# Altium project MX233.PrjPcb
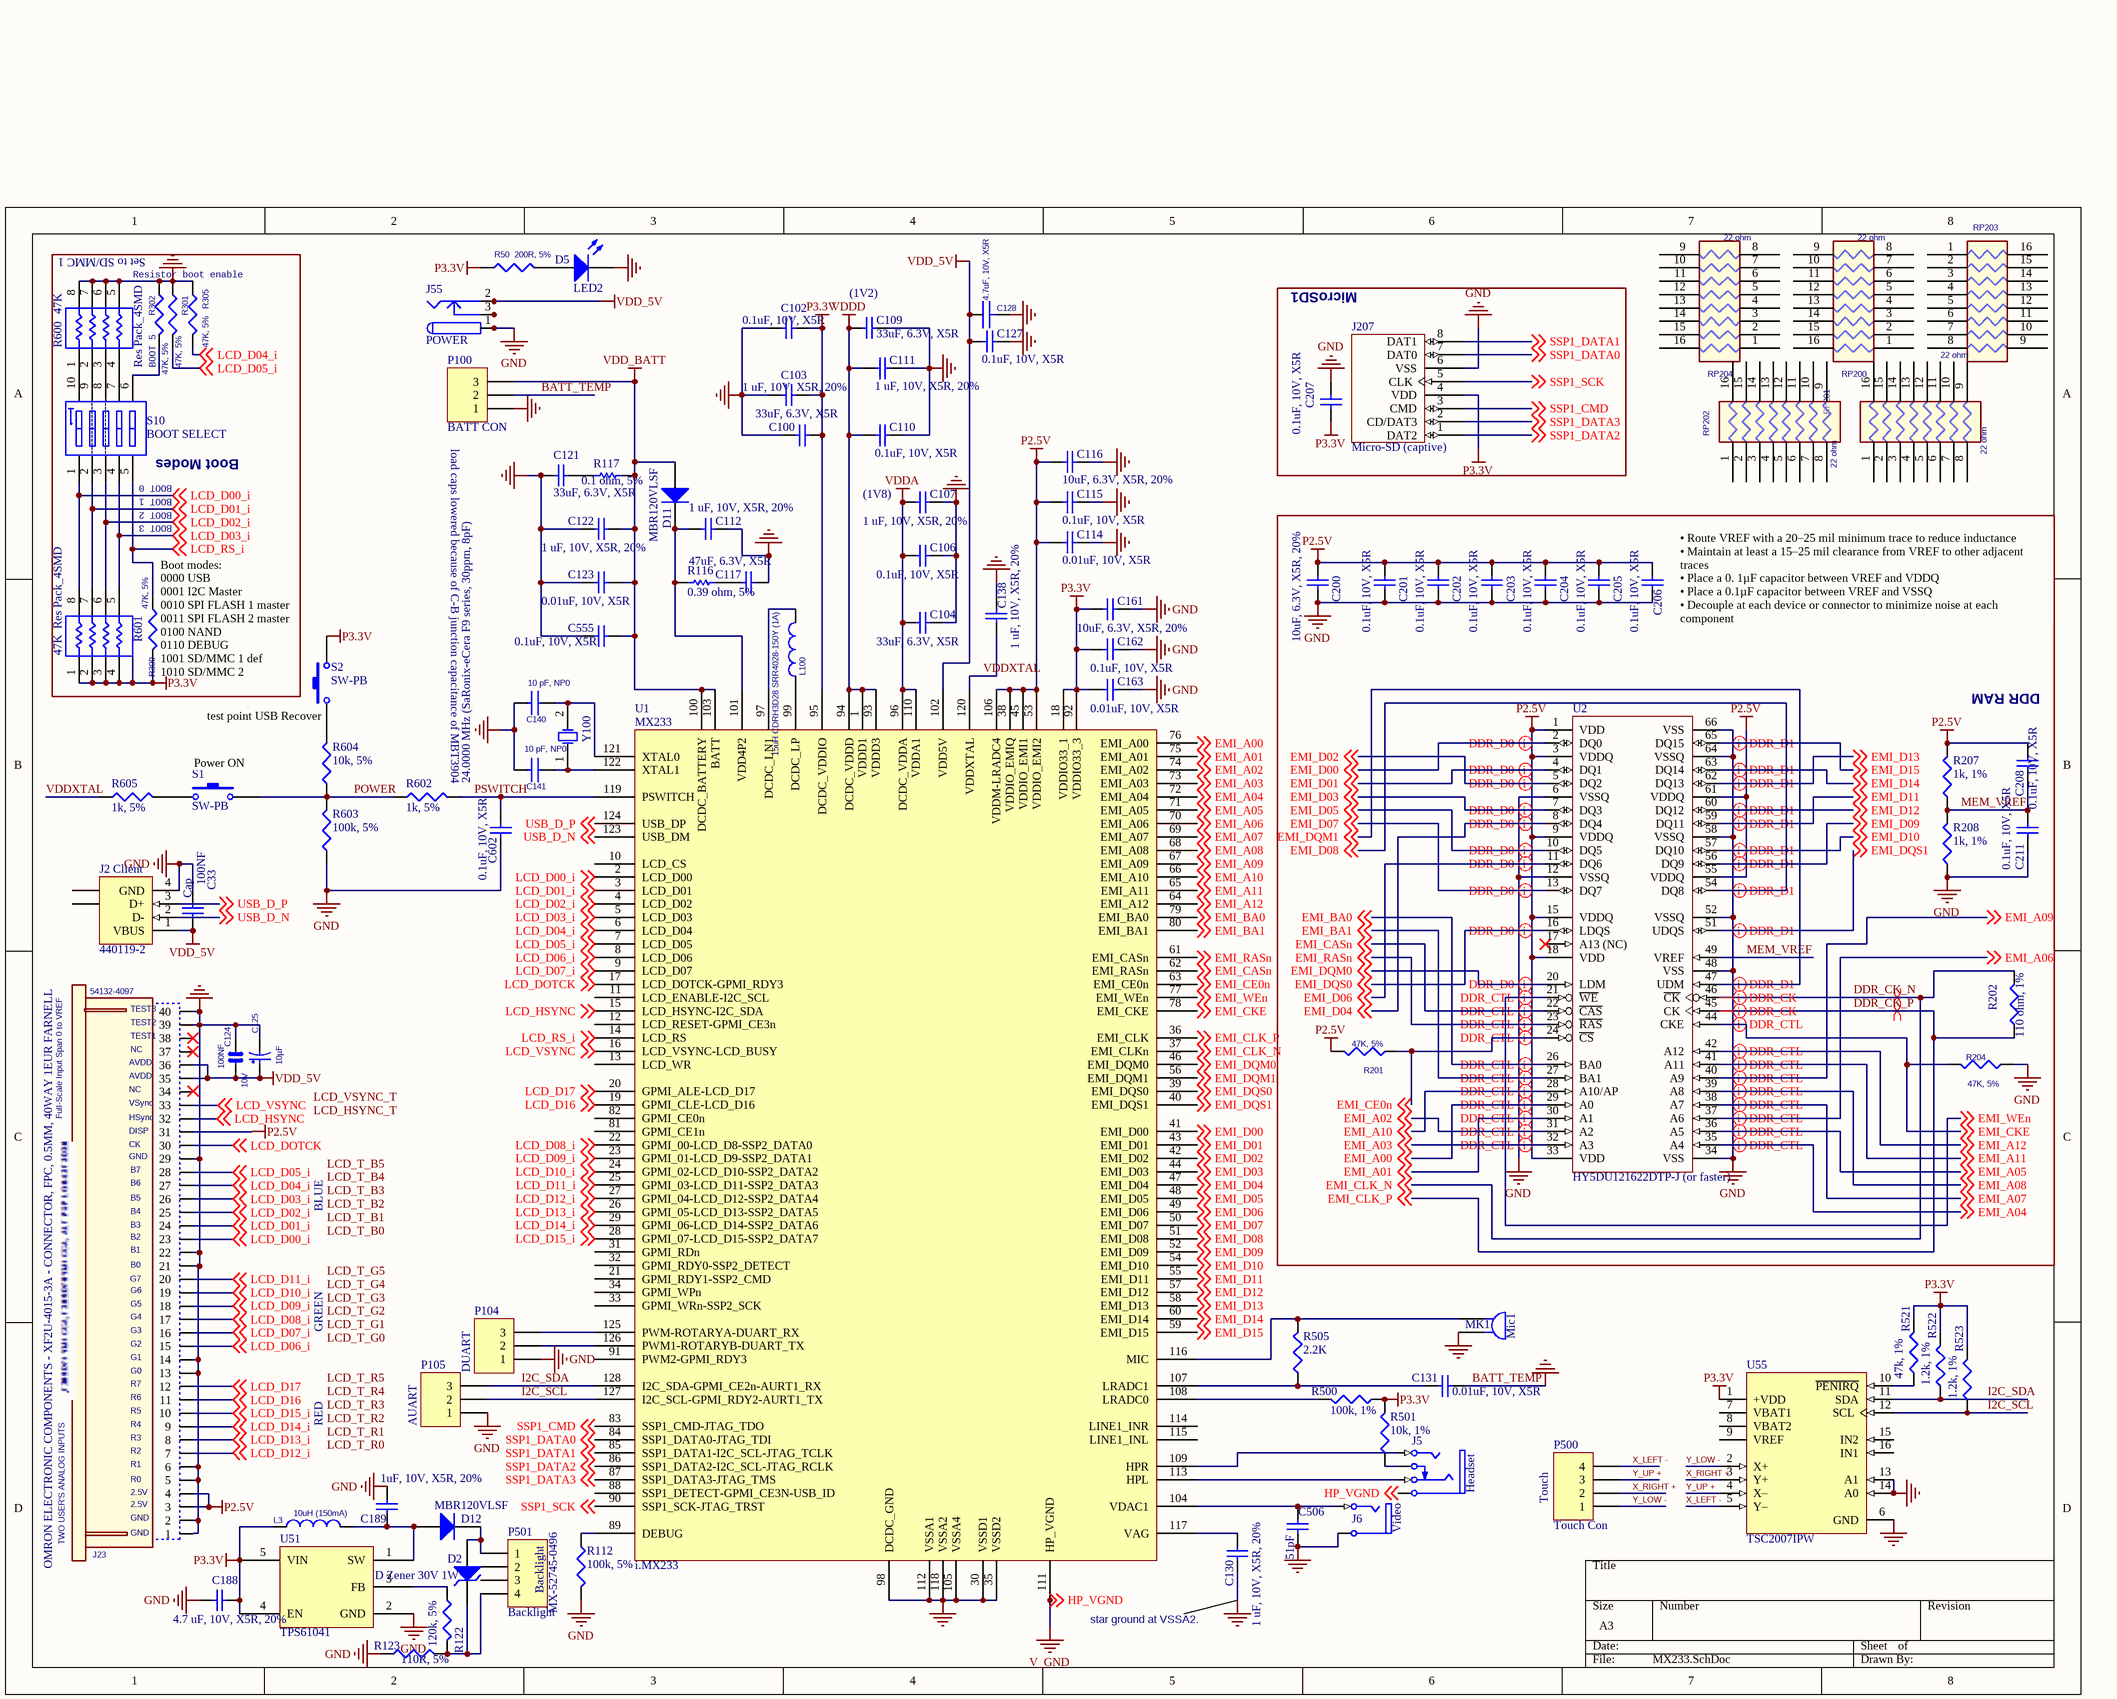
[diagram p0: MX233.SchDoc]
1 sheet, 103 parts. Net scope: global (net labels, ports and power ports of the same name join across sheets).
Board file: MX233.PcbDoc

## Sheet MX233.SchDoc
size A3

### Parts
C33  Cap  value 100NF  [CAPC1608L]
C100  33uF, 6.3V, X5R  [CAPC3216L]
C102  0.1uF, 10V, X5R  [CAPC1608L]
C103  1 uF, 10V, X5R, 20%  [CAPC1608L]
C104  33uF, 6.3V, X5R  [CAPC3216L]
C106  0.1uF, 10V, X5R  [CAPC1608L]
C107  1 uF, 10V, X5R, 20%  [CAPC1608L]
C109  33uF, 6.3V, X5R  [CAPC3216L]
C110  0.1uF, 10V, X5R  [CAPC1608L]
C111  1 uF, 10V, X5R, 20%  [CAPC1608L]
C112  1 uF, 10V, X5R, 20%  [CAPC1608L]
C114  0.01uF, 10V, X5R  [CAPC1608L]
C115  0.1uF, 10V, X5R  [CAPC1608L]
C116  10uF, 6.3V, X5R, 20%  [CAPC2012L]
C117  47uF, 6.3V, X5R  [CAPC3216L]
C121  33uF, 6.3V, X5R  [CAPC3216L]
C122  1 uF, 10V, X5R, 20%  [CAPC1608L]
C123  0.01uF, 10V, X5R  [CAPC1608L]
C124  VAL: 100NF  [CAPC1608L]  (hidden comment: GRM188-100NF-16V)
C125  TEN: 10V  VAL: 10µF  [CAPC3216L]  (hidden comment: TPSA 10uF-10V)
C127  0.1uF, 10V, X5R  [CAPC1608L]
C128  4.7uF, 10V, X5R  [CAPC2012L]
C130  1 uF, 10V, X5R, 20%  [CAPC1608L]
C131  0.01uF, 10V, X5R  [CAPC1608L]
C138  1 uF, 10V, X5R, 20%  [CAPC1608L]
C140  10 pF, NP0  [CAPC1608L]
C141  10 pF, NP0  [CAPC1608L]
C161  10uF, 6.3V, X5R, 20%  [CAPC2012L]
C162  0.1uF, 10V, X5R  [CAPC1608L]
C163  0.01uF, 10V, X5R  [CAPC1608L]
C188  4.7 uF, 10V, X5R, 20%  [CAPC1608L]
C189  1uF, 10V, X5R, 20%  [CAPC1608L]
C200  10uF, 6.3V, X5R, 20%  [CAPC2012L]
C201  0.1uF, 10V, X5R  [CAPC1608L]
C202  0.1uF, 10V, X5R  [CAPC1608L]
C203  0.1uF, 10V, X5R  [CAPC1608L]
C204  0.1uF, 10V, X5R  [CAPC1608L]
C205  0.1uF, 10V, X5R  [CAPC1608L]
C206  0.1uF, 10V, X5R  [CAPC1608L]
C207  0.1uF, 10V, X5R  [CAPC1608L]
C208  0.1uF, 10V, X5R  [CAPC1608L]
C211  0.1uF, 10V, X5R  [CAPC1608L]
C506  51pF  [CAPC1608L]
C555  0.1uF, 10V, X5R  [CAPC1608L]
C602  0.1uF, 10V, X5R  [CAPC1608L]
D2  D Zener 30V 1W  [DIODE_SMC]
D5  LED2  [DSO-F2/D6.1]
D11  MBR120VLSF  [SOD123/X.85]
D12  MBR120VLSF  [SOD123/X.85]
J2  440119-2  [440247]
J5  Headset  [JACK/6-V4A]
J6  Video  [JACK/6-V2]
J23  VAL: 54132-4097  [FH12-40S-0.5SH]  (hidden comment: FPC_54132-4097 MOLEX)
J55  POWER  [KLD-0202]
J207  Micro-SD (captive)  [SDAMB-012_miniSD]
L3  10uH (150mA)  [INDC4532L]
L100  15uH CDRH3D28 SRR4028-150Y (1A)  [INDC4532L]
MK1  Mic1  [PIN2]
P100  BATT CON  [HDR1X3]
P104  DUART  [HDR1X3]
P105  AUART  [HDR1X3]
P500  Touch Con  [FH12-10(4)SA-1SH]
P501  Backlight  [FH12-10(4)SA-1SH]
R50  200R, 5%  [RESC1608L]
R112  100k, 5%  [RESC1608L]
R116  0.39 ohm, 5%  [RESC1608L]
R117  0.1 ohm, 5%  [RESC1608L]
R122  120k, 5%  [RESC1608L]
R123  110R, 5%  [RESC1608L]
R201  47K, 5%  [RESC1608L]
R202  110 ohm, 1%  [RESC1608L]
R204  47K, 5%  [RESC1608L]
R207  1k, 1%  [RESC1608L]
R208  1k, 1%  [RESC1608L]
R300  47K, 5%  [RESC1608L]
R301  47K, 5%  [RESC1608L]
R302  47K, 5%  [RESC1608L]
R305  47K, 5%  [RESC1608L]
R500  100k, 1%  [RESC1608L]
R501  10k, 1%  [RESC1608L]
R505  2.2K  [RESC1608L]
R521  47k, 1%  [RESC1608L]
R522  1.2k, 1%  [RESC1608L]
R523  1.2k, 1%  [RESC1608L]
R600  Res Pack_4SMD  value 47K  [EXB38V]
R601  Res Pack_4SMD  value 47K  [EXB38V]
R602  1k, 5%  [RESC1608L]
R603  100k, 5%  [RESC1608L]
R604  10k, 5%  [RESC1608L]
R605  1k, 5%  [RESC1608L]
RP200  22 ohm  [EXB2HV]
RP201  22 ohm  [EXB2HV]
RP202  22 ohm  [EXB2HV]
RP203  22 ohm  [EXB2HV]
RP204  22 ohm  [EXB2HV]
S1  SW-PB  [SPST-2]
S2  SW-PB  [SPST-2]
S10  BOOT SELECT  [DIP-10/D14.5]
U1  MX233  [TSQFP40P1600X1600-128M]
U2  HY5DU121622DTP-J (or faster)  [TSOP65P1400-36M - duplicate]
U51  TPS61041  [SOT23-5BM]
U55  TSC2007IPW  [PW016]
Y100  24.0000 MHz (SaRonix-eCera F9 series, 30ppm, 8pF)  [HC-49U]

### Blocks framed on the sheet
Boot Modes: R300-R302 R305 R600 R601 S10
MicroSD1: C207 J207
DDR RAM: C200-C206 C208 C211 R201 R202 R204 R207 R208 U2

### Nets
BATT_TEMP: C33.2 C100.1 C102.2 C103.1 C104.1 C106.2 C107.1 C109.1 C110.2 C111.1 C112.1 C114.2 C115.2 C116.1 C117.1 C121.1 C122.1 C123.2 C127.2 C128.2 C130.1 C131.2 C138.1 C140.2 C141.2 C161.1 C162.2 C163.2 C188.1 C189.2 C200.2 C201.2 C202.2 C203.2 C204.2 C205.2 C206.2 C207.2 C211.2 C506.1 C555.2 C602.2 D5.2(K) J2.4(GND) J6.5(S) J55.1 J55.1A J55.1B J207.6(VSS) MK1.2 P100.1 P100.2 P104.1 P105.1 R112.2 R123.1 R204.2 R208.1 R301.1 R302.1 R305.1 R600.5 R600.6 R600.7 R600.8 R603.1 U1.30(VSSD1) U1.35(VSSD2) U1.98(DCDC_GND) U1.105(VSSA4) U1.112(VSSA1) U1.118(VSSA2) U2.6(VSSQ) U2.12(VSSQ) U2.34(VSS) U2.48(VSS) U2.52(VSSQ) U2.58(VSSQ) U2.64(VSSQ) U2.66(VSS) U51.2(GND) U55.6(GND) U55.13(A1) U55.14(A0)  [also labelled GND]
GND_POWER: C124.1(E1) C125.2(M) J23.1 J23.2 J23.5 J23.6 J23.13 J23.14 J23.21 J23.22 J23.29 J23.39 J23.40
P2.5V: C114.1 C115.1 C116.2 C200.1 C201.1 C202.1 C203.1 C204.1 C205.1 C206.1 C208.1 J23.3 J23.4 J23.31 R201.1 R207.2 U1.38(VDDIO_EMIQ) U1.45(VDDIO_EMI1) U1.53(VDDIO_EMI2) U1.106(VDDM-LRADC4) U2.1(VDD) U2.3(VDDQ) U2.9(VDDQ) U2.15(VDDQ) U2.18(VDD) U2.33(VDD) U2.55(VDDQ) U2.61(VDDQ)
P3.3V: C100.2 C102.1 C103.2 C161.2 C162.1 C163.1 C188.2 C207.1 J207.4(VDD) L3.1 R50.1 R300.2 R500.1 R501.2 R521.2 R522.2 R523.2 R601.1 R601.2 R601.3 R601.4 S2.2 U1.18(VDDIO33_1) U1.92(VDDIO33_3) U1.95(DCDC_VDDIO) U51.4(EN) U51.5(VIN) U55.1(+VDD)
V_GND: J5.5(S) U1.111(HP_VGND) ; off-sheet HP_VGND  [also labelled HP_VGND]
VDD_5V: C33.1 C124.2(E2) C125.1(P) C127.1 C128.1 J2.1(VBUS) J23.35 J23.36 J55.2 J55.2A J55.2B U1.102(VDD5V)
VDD_BATT: C122.2 C123.1 C555.1 D11.1(A) P100.3 R117.1 U1.100(DCDC_BATTERY) U1.103(BATT)
VDDA: C104.2 C106.1 C107.2 U1.96(DCDC_VDDA) U1.110(VDDA1)
VDDD: C109.2 C110.1 C111.2 U1.1(VDDD1) U1.93(VDDD3) U1.94(DCDC_VDDD)
DDR_CK_N: R202.2 U1.37(EMI_CLKn) U2.46(~{CK}) ; off-sheet EMI_CLK_N  [also labelled EMI_CLK_N]
DDR_CK_P: R202.1 U1.36(EMI_CLK) U2.45(CK) ; off-sheet EMI_CLK_P  [also labelled EMI_CLK_P]
EMI_A00: U1.76(EMI_A00) U2.29(A0) ; off-sheet EMI_A00
EMI_A01: U1.75(EMI_A01) U2.30(A1) ; off-sheet EMI_A01
EMI_A02: U1.74(EMI_A02) U2.31(A2) ; off-sheet EMI_A02
EMI_A03: U1.73(EMI_A03) U2.32(A3) ; off-sheet EMI_A03
EMI_A04: U1.72(EMI_A04) U2.35(A4) ; off-sheet EMI_A04
EMI_A05: U1.71(EMI_A05) U2.36(A5) ; off-sheet EMI_A05
EMI_A06: U1.70(EMI_A06) U2.37(A6) ; off-sheet EMI_A06
EMI_A07: U1.69(EMI_A07) U2.38(A7) ; off-sheet EMI_A07
EMI_A08: U1.68(EMI_A08) U2.39(A8) ; off-sheet EMI_A08
EMI_A09: U1.67(EMI_A09) U2.40(A9) ; off-sheet EMI_A09
EMI_A10: U1.66(EMI_A10) U2.28(A10/AP) ; off-sheet EMI_A10
EMI_A11: U1.65(EMI_A11) U2.41(A11) ; off-sheet EMI_A11
EMI_A12: U1.64(EMI_A12) U2.42(A12) ; off-sheet EMI_A12
EMI_BA0: U1.79(EMI_BA0) U2.26(BA0) ; off-sheet EMI_BA0
EMI_BA1: U1.80(EMI_BA1) U2.27(BA1) ; off-sheet EMI_BA1
EMI_CASn: U1.62(EMI_RASn) U2.22(~{CAS}) ; off-sheet EMI_CASn
EMI_CE0n: R201.2 U1.63(EMI_CE0n) U2.24(~{CS}) ; off-sheet EMI_CE0n
EMI_CKE: R204.1 U1.78(EMI_CKE) U2.44(CKE) ; off-sheet EMI_CKE
EMI_D00: U1.41(EMI_D00) U2.2(DQ0) ; off-sheet EMI_D00
EMI_D01: U1.43(EMI_D01) U2.4(DQ1) ; off-sheet EMI_D01
EMI_D02: U1.42(EMI_D02) U2.5(DQ2) ; off-sheet EMI_D02
EMI_D03: U1.44(EMI_D03) U2.7(DQ3) ; off-sheet EMI_D03
EMI_D04: U1.47(EMI_D04) U2.8(DQ4) ; off-sheet EMI_D04
EMI_D05: U1.48(EMI_D05) U2.10(DQ5) ; off-sheet EMI_D05
EMI_D06: U1.49(EMI_D06) U2.11(DQ6) ; off-sheet EMI_D06
EMI_D07: U1.50(EMI_D07) U2.13(DQ7) ; off-sheet EMI_D07
EMI_D08: U1.51(EMI_D08) U2.54(DQ8) ; off-sheet EMI_D08
EMI_D09: U1.52(EMI_D09) U2.56(DQ9) ; off-sheet EMI_D09
EMI_D10: U1.54(EMI_D10) U2.57(DQ10) ; off-sheet EMI_D10
EMI_D11: U1.55(EMI_D11) U2.59(DQ11) ; off-sheet EMI_D11
EMI_D12: U1.57(EMI_D12) U2.60(DQ12) ; off-sheet EMI_D12
EMI_D13: U1.58(EMI_D13) U2.62(DQ13) ; off-sheet EMI_D13
EMI_D14: U1.60(EMI_D14) U2.63(DQ14) ; off-sheet EMI_D14
EMI_D15: U1.59(EMI_D15) U2.65(DQ15) ; off-sheet EMI_D15
EMI_DQM0: U1.46(EMI_DQM0) U2.20(LDM) ; off-sheet EMI_DQM0
EMI_DQM1: U1.56(EMI_DQM1) U2.47(UDM) ; off-sheet EMI_DQM1
EMI_DQS0: U1.39(EMI_DQS0) U2.16(LDQS) ; off-sheet EMI_DQS0
EMI_DQS1: U1.40(EMI_DQS1) U2.51(UDQS) ; off-sheet EMI_DQS1
EMI_RASn: U1.61(EMI_CASn) U2.23(~{RAS}) ; off-sheet EMI_RASn
EMI_WEn: U1.77(EMI_WEn) U2.21(~{WE}) ; off-sheet EMI_WEn
I2C_SCL: P105.2 R523.1 U1.127(I2C_SCL-GPMI_RDY2-AURT1_TX) U55.12(SCL)
I2C_SDA: P105.3 R522.1 U1.128(I2C_SDA-GPMI_CE2n-AURT1_RX) U55.11(SDA)
LCD_D00_i: J23.23 R601.8 S10.1(A1) U1.2(LCD_D00) ; off-sheet LCD_D00_i
LCD_D01_i: J23.24 R601.7 S10.2(A2) U1.3(LCD_D01) ; off-sheet LCD_D01_i
LCD_D02_i: J23.25 R601.6 S10.3(A3) U1.4(LCD_D02) ; off-sheet LCD_D02_i
LCD_D03_i: J23.26 R601.5 S10.4(A4) U1.5(LCD_D03) ; off-sheet LCD_D03_i
LCD_D04_i: J23.27 R305.2 U1.6(LCD_D04) ; off-sheet LCD_D04_i
LCD_D05_i: J23.28 R301.2 U1.7(LCD_D05) ; off-sheet LCD_D05_i
LCD_D06_i: J23.15 U1.8(LCD_D06) ; off-sheet LCD_D06_i
LCD_D07_i: J23.16 U1.9(LCD_D07) ; off-sheet LCD_D07_i
LCD_D08_i: J23.17 U1.22(GPMI_00-LCD_D8-SSP2_DATA0) ; off-sheet LCD_D08_i
LCD_D09_i: J23.18 U1.23(GPMI_01-LCD_D9-SSP2_DATA1) ; off-sheet LCD_D09_i
LCD_D10_i: J23.19 U1.24(GPMI_02-LCD_D10-SSP2_DATA2) ; off-sheet LCD_D10_i
LCD_D11_i: J23.20 U1.25(GPMI_03-LCD_D11-SSP2_DATA3) ; off-sheet LCD_D11_i
LCD_D12_i: J23.7 U1.27(GPMI_04-LCD_D12-SSP2_DATA4) ; off-sheet LCD_D12_i
LCD_D13_i: J23.8 U1.26(GPMI_05-LCD_D13-SSP2_DATA5) ; off-sheet LCD_D13_i
LCD_D14_i: J23.9 U1.29(GPMI_06-LCD_D14-SSP2_DATA6) ; off-sheet LCD_D14_i
LCD_D15_i: J23.10 U1.28(GPMI_07-LCD_D15-SSP2_DATA7) ; off-sheet LCD_D15_i
LCD_D16: J23.11 U1.19(GPMI_CLE-LCD_D16) ; off-sheet LCD_D16
LCD_D17: J23.12 U1.20(GPMI_ALE-LCD_D17) ; off-sheet LCD_D17
LCD_DOTCK: J23.30 U1.17(LCD_DOTCK-GPMI_RDY3) ; off-sheet LCD_DOTCK
LCD_HSYNC: J23.32 U1.15(LCD_HSYNC-I2C_SDA) ; off-sheet LCD_HSYNC
LCD_RS_i: R300.1 S10.5(A5) U1.14(LCD_RS) ; off-sheet LCD_RS_i
LCD_VSYNC: J23.33 U1.16(LCD_VSYNC-LCD_BUSY) ; off-sheet LCD_VSYNC
MEM_VREF: C208.2 C211.1 R207.1 R208.2 U2.49(VREF)
POWER: R602.1 R603.2 R604.1 S1.2
PSWITCH: C602.1 R602.2 U1.119(PSWITCH)
SSP1_CMD: J207.3(CMD) U1.83(SSP1_CMD-JTAG_TDO) ; off-sheet SSP1_CMD
SSP1_DATA0: J207.7(DAT0) U1.84(SSP1_DATA0-JTAG_TDI) ; off-sheet SSP1_DATA0
SSP1_DATA1: J207.8(DAT1) U1.85(SSP1_DATA1-I2C_SCL-JTAG_TCLK) ; off-sheet SSP1_DATA1
SSP1_DATA2: J207.1(DAT2) U1.86(SSP1_DATA2-I2C_SCL-JTAG_RCLK) ; off-sheet SSP1_DATA2
SSP1_DATA3: J207.2(CD/DAT3) U1.87(SSP1_DATA3-JTAG_TMS) ; off-sheet SSP1_DATA3
SSP1_SCK: J207.5(CLK) U1.90(SSP1_SCK-JTAG_TRST) ; off-sheet SSP1_SCK
USB_D_N: J2.2(D-) U1.123(USB_DM) ; off-sheet USB_D_N
USB_D_P: J2.3(D+) U1.124(USB_DP) ; off-sheet USB_D_P
VDDXTAL: C138.2 R605.1 U1.120(VDDXTAL)
X_LEFT -: P500.4 U55.5(Y–)
X_RIGHT +: P500.2 U55.3(Y+)
Y_LOW -: P500.1 U55.2(X+)
Y_UP +: P500.3 U55.4(X–)
NetC112_2: C112.2 D11.2(K) R116.1 U1.101(VDD4P2)
NetC117_2: C117.2 R116.2
NetC121_2: C121.2 R117.2
NetC130_2: C130.2 U1.117(VAG)
NetC131_1: C131.1 R505.1 U1.107(LRADC1)
NetC140_1: C140.1 U1.121(XTAL0) Y100.2(OSC2)
NetC141_1: C141.1 U1.122(XTAL1) Y100.1(OSC1)
NetC189_1: C189.1 D12.1(A) L3.2 U51.1(SW)
NetC506_2: C506.2 J6.1(T) U1.104(VDAC1)
NetD2_1: D2.1(A) D12.2(K) P501.1
NetD2_2: D2.2(K) P501.4 R122.2 R123.2
NetD5_1: D5.1(A) R50.2
NetJ5_1: J5.1(T) U1.109(HPR)
NetJ5_3: J5.3(R) U1.113(HPL)
NetJ5_4: J5.4(RN) R501.1
NetJ55_3: J55.3 J55.3A J55.3B
NetL100_1: L100.1 U1.99(DCDC_LP)
NetL100_2: L100.2 U1.97(DCDC_LN1)
NetMK1_1: MK1.1 R505.2 U1.116(MIC)
NetP104_2: P104.2 U1.126(PWM1-ROTARYB-DUART_TX)
NetP104_3: P104.3 U1.125(PWM-ROTARYA-DUART_RX)
NetR112_1: R112.1 U1.89(DEBUG)
NetR122_1: R122.1 U51.3(FB)
NetR302_2: R302.2 S10.6(B5)
NetR500_2: R500.2 U1.108(LRADC0)
NetR521_1: R521.1 U55.10(~{PENIRQ})
NetR600_1: R600.1 S10.10(B1)
NetR600_2: R600.2 S10.9(B2)
NetR600_3: R600.3 S10.8(B3)
NetR600_4: R600.4 S10.7(B4)
NetR604_2: R604.2 S2.1
NetR605_2: R605.2 S1.1

Not connected (* = marked no-connect by the designer): J2 5(SHLD) 6(SHLD); J23 34 37* 38*; P501 2 3; RP200 1 2 3 4 5 6 7 8 9 10 11 12 13 14 15 16; RP201 1 2 3 4 5 6 7 8 9 10 11 12 13 14 15 16; RP202 1 2 3 4 5 6 7 8 9 10 11 12 13 14 15 16; RP203 1 2 3 4 5 6 7 8 9 10 11 12 13 14 15 16; RP204 1 2 3 4 5 6 7 8 9 10 11 12 13 14 15 16; U1 10(LCD_CS) 11(LCD_ENABLE-I2C_SCL) 12(LCD_RESET-GPMI_CE3n) 13(LCD_WR) 21(GPMI_RDY1-SSP2_CMD) 31(GPMI_RDn) 32(GPMI_RDY0-SSP2_DETECT) 33(GPMI_WRn-SSP2_SCK) 34(GPMI_WPn) 81(GPMI_CE1n) 82(GPMI_CE0n) 88(SSP1_DETECT-GPMI_CE3N-USB_ID) 91(PWM2-GPMI_RDY3) 114(LINE1_INR) 115(LINE1_INL); U2 17(A13_(NC))*; U55 7(VBAT1) 8(VBAT2) 9(VREF) 15(IN2) 16(IN1)

### Layout directives
differential pair: DDR_CK_N, DDR_CK_P
net class DDR_D0: EMI_D00, EMI_D02, EMI_D03, EMI_D04, EMI_D05, EMI_D06, EMI_D07, EMI_DQM0, EMI_DQS0
net class DDR_D1: EMI_D01, EMI_D08, EMI_D09, EMI_D10, EMI_D11, EMI_D12, EMI_D13, EMI_D14, EMI_D15, EMI_DQM1, EMI_DQS1
net class DDR_CTL: EMI_A00, EMI_A01, EMI_A02, EMI_A03, EMI_A04, EMI_A05, EMI_A06, EMI_A07, EMI_A08, EMI_A09, EMI_A10, EMI_A11, EMI_A12, EMI_BA0, EMI_BA1, EMI_CASn, EMI_CE0n, EMI_CKE, EMI_RASn, EMI_WEn
net class DDR_CK: DDR_CK_N, DDR_CK_P

### Notes on the sheet
- Set to SD/MMC 1
- Resistor boot enable
- (near C109) (1V2)
- (near R302) BOOT 5
- (near R602) load caps lowered because of C-B junction capacitance of MBT3904
- (near S10) --------------
- (near S10) BOOT 1
- (near S10) BOOT 0
- BOOT 3
- BOOT 2
- (near C107) (1V8)
- (near C206) • Route VREF with a 20–25 mil minimum trace to reduce inductance
  • Maintain at least a 15–25 mil clearance from VREF to other adjacent traces
  • Place a 0. 1µF capacitor between VREF and VDDQ
  • Place a 0.1µF capacitor between VREF and VSSQ
  • Decouple at each device or connector to minimize noise at each component
  (Per Micron TN-46-14)
- (near R300) Boot modes:
  0000 USB
  0001 I2C Master
  0010 SPI FLASH 1 master
  0011 SPI FLASH 2 master
  0100 NAND
  0110 DEBUG
  1001 SD/MMC 1 def
  1010 SD/MMC 2
- (near S1) Power ON
- (near S2) test point USB Recover
- (near J2) Client
- (near J23) NC
- (near J23) TEST1
- (near J23) TEST2
- (near J23) TEST3
- Full-Scale Input Span 0 to VREF
- (near J23) HSync
- (near J23) VSync
- (near J23) AVDD
- (near J23) GND
- (near J23) CK
- (near J23) DISP
- (near J23) B6
- (near J23) B7
- (near J23) B1
- (near J23) B2
- (near J23) B3
- (near J23) B4
- (near J23) B5
- BLUE
- (near J23) G7
- (near J23) G4
- (near J23) G5
- (near J23) G6
- (near J23) B0
- (near J23) R7
- (near J23) G0
- (near J23) G1
- (near J23) G2
- (near J23) G3
- GREEN
- (near J23) R2
- (near J23) R3
- (near J23) R4
- (near J23) R5
- (near J23) R6
- RED
- (near J23) 2.5V
- (near J23) R0
- (near J23) R1
- (near P500) Touch
- OMRON ELECTRONIC COMPONENTS - XF2U-4015-3A - CONNECTOR, FPC, 0.5MM, 40WAY 1EUR FARNELL
- TWO USER'S ANALOG INPUTS
- Backlight
- (near R112) MX-52745-0496
- star ground at VSSA2.
- Labels drawn without touching a wire or pin: LCD_HSYNC_T, LCD_T_B0, LCD_T_B1, LCD_T_B2, LCD_T_B3, LCD_T_B4, LCD_T_B5, LCD_T_G0, LCD_T_G1, LCD_T_G2, LCD_T_G3, LCD_T_G4, LCD_T_G5, LCD_T_R0, LCD_T_R1, LCD_T_R2, LCD_T_R3, LCD_T_R4, LCD_T_R5, LCD_VSYNC_T

### Library data of the parts
C33 C100 C102-C104 C106 C107 C109-C112 C114-C117 C121-C123 C127 C130 C131 C138 C161-C163 C188 C189 C200-C208 C211 C506 C555 C602 = Cap Semi: Capacitor (Semiconductor SIM Model); Published: 8-Jun-2000; LatestRevisionDate: 17-Jul-2002; LatestRevisionNote: Re-released for DXP Platform.; PackageReference: C1206; Publisher: Altium Limited
C124 = GRM188-100NF-16V: REF: GRM188R71C104KA01D; TOL: 10%; DESIG: Ceramic Capacitor; BOI: 0603; TEN: 16V; FAB: MURATA; DEV: C0603
C125 = TPSA 10uF-10V: DEV: CPS_3216_01; FAB: AVX; TEMP: -55°C à 125°C; BOI: A; DESIG: LOW ESR TANTALUM CAPACITOR; TOL: 10%; REF: TPSA106K010R1800
C128 = C: SIGMATEL PN: C0475-3325
C140 C141 = CAP NP: Right: 20; Bottom: 10
D2 = D Zener: Zener Diode; Published: 8-Jun-2000; LatestRevisionDate: 17-Jul-2002; LatestRevisionNote: Re-released for DXP Platform.; PackageReference: DIODE-0.7; Publisher: Altium Limited
D5 = LED2: Typical RED, GREEN, YELLOW, AMBER GaAs LED; Published: 8-Jun-2000; LatestRevisionDate: 17-Jul-2002; LatestRevisionNote: Re-released for DXP Platform.; PackageVersion: Feb-2002; PackageReference: 3.2X1.6X1.1; Publisher: Altium Limited
D11 D12 = Diode 1N5408: 3 Amp Medium Power Silicon Rectifier Diode; Published: 8-Jun-2000; LatestRevisionDate: 17-Jul-2002; LatestRevisionNote: Re-released for DXP Platform.; DatasheetDocument: Aug-1984; PackageReference: DO-201AD; Publisher: Altium Limited; ComponentLink1Description: Manufacturer Link; ComponentLink1URL: http://www.irf.com/
J2 = 440119-2: USB 1.1, Right Angle, Thru-Hole, B Type, Receptacle, 4 Position, Black; ContactMaterial: Copper Alloy; ContactPlating: Gold Flash over Nickel; TerminationLength: 2.84mm [0.112in.]; PCB_Layout: Complies with manufacturer's recommendation.; DrillSize: Corresponds to nominal value.; PanelGround: Without; Published: 15-Jul-2004; DatasheetDocument: 12-Jan-2004; PackageDocument: 12-Jan-2004; PackageReference: 440119; Publisher: Altium Limited; HousingMaterial: Thermoplastic; ComponentLink1Description: Manufacturer Link; ComponentLink1URL: http://www.tycoelectronics.com/; ComponentLink2Description: Packaging Specification; ComponentLink2URL: http://ecommas.tycoelectronics.com/commerce/DocumentDelivery/DDEController?Action=showdoc&DocId=Customer+Drawing%7F440119%7FC%7Ftif%7FEnglish%7FC_440119_C.tif
J5 = Phonejack3 RN: Jack Socket, 1/4" [6.5mm], Thru-Hole, Vertical, 3-Conductor with Tip open & Ring closed; PackageDocument: 2003; PCB_Layout: Complies with manufacturer's recommendation.; DrillAndSlotSize: Corresponds to nominal value.; Published: 15-Jul-2004; DatasheetDocument: 2003; PackageReference: S1VS_SBS; Publisher: Altium Limited; ComponentLink1Description: Manufacturer Link; ComponentLink1URL: http://www.cliffuk.co.uk/
J6 = Phonejack2: Jack Socket, 1/4" [6.5mm], Thru-Hole, Vertical, 2-Conductor Open Circuit; PackageDocument: 2003; PCB_Layout: Complies with manufacturer's recommendation.; DrillAndSlotSize: Corresponds to nominal value.; LatestRevisionDate: 15-Jul-2004; LatestRevisionNote: Component Replaced.; DatasheetDocument: 2003; PackageReference: S1VS_SNS; Publisher: Altium Limited; ComponentLink1Description: Manufacturer Link; ComponentLink1URL: http://www.cliffuk.co.uk/
J23 = FPC_54132-4097 MOLEX: BOI: 40 pins; DESIG: FPC CONNECTOR ZIP; DEV: JFS_54132ZIF40P_01; FAB: MOLEX; REF: 54132-4097
J55 = PWR2.5: Low Voltage Power Supply Connector; Published: 17-Dec-2003; DatasheetDocument: 09-May-2002; Publisher: Altium Limited; ComponentLink1Description: Manufacturer Link; ComponentLink1URL: http://domino.kycon.com/internet/Products.html
J207 = MICRO_SD: Captive Micro-SD card for firmware images
L3 L100 = INDUCTOR: SIGMATEL PN: L1505-F000
MK1 = Mic1: Microphone; Published: 24-Mar-1999; LatestRevisionDate: 17-Jul-2002; LatestRevisionNote: Re-released for DXP Platform.; PackageReference: PIN2; Publisher: Altium Limited
P100 P104 P105 = Header 3: Header, 3-Pin; LatestRevisionDate: 17-Jul-2002; LatestRevisionNote: Re-released for DXP Platform.; Publisher: Altium Limited
P500 P501 = Header 4: Header, 4-Pin; LatestRevisionDate: 17-Jul-2002; LatestRevisionNote: Re-released for DXP Platform.; Publisher: Altium Limited
R50 R300-R302 R305 = RESISTOR: SIGMATEL PN: NOPOP
R112 R122 R123 R202 R207 R208 R500 R501 R505 R521-R523 R602-R605 = Res3: Resistor; Published: 8-Jun-2000; LatestRevisionNote: PCB Footprint replaced.; Publisher: Altium Limited
  R112 R122 R123 R202 R207 R208 R500 R501 R505 R521-R523: LatestRevisionDate: 4-Mar-2005
  R602-R605: LatestRevisionDate: 04-Mar-2005; PackageReference: J1-0603
R116 R117 = Res1: Resistor; Value: 100k; Published: 8-Jun-2000; LatestRevisionDate: 17-Jul-2002; LatestRevisionNote: Re-released for DXP Platform.; PackageReference: AXIAL-0.3; Publisher: Altium Limited
R201 R204 = R: SIGMATEL PN: R0473-2004; Type: 10%
R600 R601 = Res Pack_4SMD: Isolated Resistor Network; Published: 24-Mar-1999; LatestRevisionDate: 29-May-2009; LatestRevisionNote: IPC-7351 Footprint Added.; PackageReference: SO-16; Publisher: Altium Limited; PackageDescription: 16-Pin Small Outline Integrated Circuit 1.27 mm Pitch; Code_JEDEC: MS-012-AC; Code_IPC: SOIC127P600-16
RP200-RP204 = RESISTOR DIP 8: SIGMATEL PN: NOPOP
S1 S2 = SW-PB: Switch; Published: 24-Mar-1999; LatestRevisionDate: 17-Jul-2002; LatestRevisionNote: Re-released for DXP Platform.; PackageReference: SPST-2; Publisher: Altium Limited
S10 = SW DIP-5: DIP Switch, 5 Position, SPST; Published: 24-Mar-1999; LatestRevisionDate: 17-Jul-2002; LatestRevisionNote: Re-released for DXP Platform.; PackageReference: N10A; Publisher: Altium Limited
U1 = i.MX233: ARM i.MX233; MX233: ARM9
U2 = HY5DU561622E(L)TP: 512 Mbit DDR SDRAM, x16
U55 = TSC2003IPW: 4-Wire Resistive Touch Screen Controller, 16-Pin TSSOP, Pb-Free; Published: 6-Oct-2005; DatasheetVersion: Jan-2005; PackageVersion: Feb-1999; PackageReference: PW016; Publisher: Altium Limited; PackageDescription: Shrink Small Outline; 16 Leads; Body Width 4.4 mm; Pitch 0.65 mm; ComponentLink1Description: Manufacturer Link; ComponentLink1URL: http://focus.ti.com/docs/prod/folders/print/tsc2003.html; ComponentLink2Description: Datasheet; ComponentLink2URL: http://focus.ti.com/lit/ds/symlink/tcs2003.pdf
Y100 = XTAL: Crystal Oscillator; Published: 8-Jun-2000; LatestRevisionDate: 17-Jul-2002; LatestRevisionNote: Re-released for DXP Platform.; PackageReference: R38; Publisher: Altium Limited